# EAGLE design v1_1 (EAGLE 9.6.1)
CNAME: GSM Controll; CREVISION: 1.1; DESIGNER: Miroslav Pivovarsky
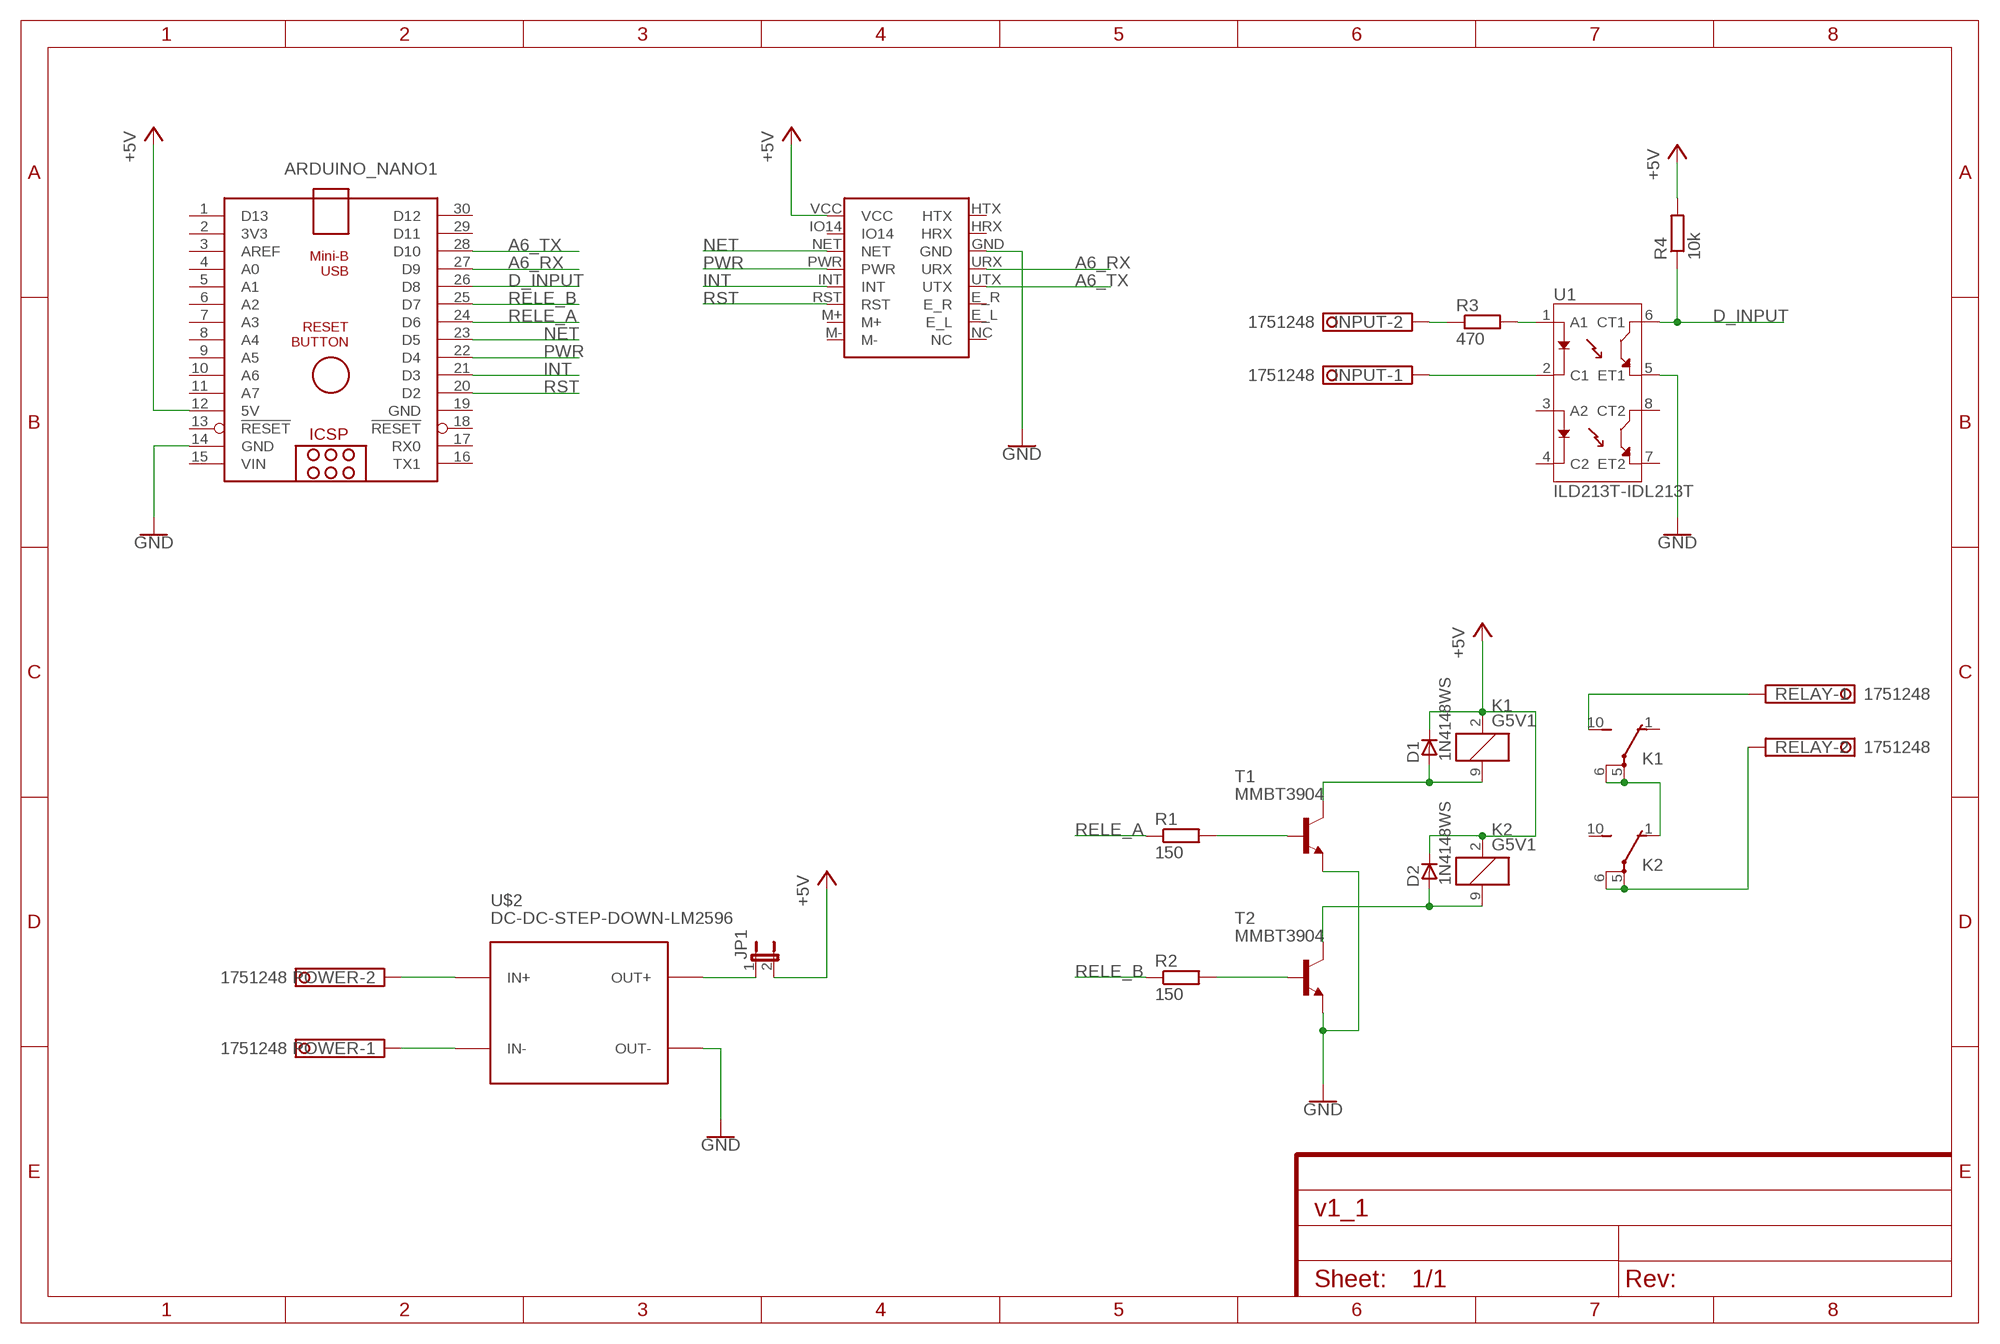
[diagram p0: schematic, sheet 1]

## Parts
ARDUINO_NANO1  ARDUINO_NANO  [ARDUINO_NANO]
D1  1N4148WS  [SOD323F]
D2  1N4148WS  [SOD323F]
INPUT  1751248  [1751248]
JP1  JP1E  [JP1]
K1  G5V1  [G5V1]
K2  G5V1  [G5V1]
POWER  1751248  [1751248]
R1  150  R-EU_R0805  [R0805]
R2  150  R-EU_R0805  [R0805]
R3  470  R-EU_R0805  [R0805]
R4  10k  R-EU_R0805  [R0805]
RELAY  1751248  [1751248]
T1  MMBT3904  MMBT3904LT1-NPN-SOT23-BEC  [SOT23-BEC]
T2  MMBT3904  MMBT3904LT1-NPN-SOT23-BEC  [SOT23-BEC]
U1  ILD213T-IDL213T  [SO08]
U$1  GPRS_A6_MINI  [A6_MINI]
U$2  DC-DC-STEP-DOWN-LM2596  [DC-DC-STEP-DOWN-LM2596]

## Nets
+5V: ARDUINO_NANO1.12(5V) D1.C D2.C JP1.2 K1.2 K2.2 R4.2 U$1.VCC
A6_RX: ARDUINO_NANO1.27(D9) U$1.URX
A6_TX: ARDUINO_NANO1.28(D10) U$1.UTX
D_INPUT: ARDUINO_NANO1.26(D8) R4.1 U1.6(CT1)
GND: ARDUINO_NANO1.14(GND) T1.E T2.E U1.5(ET1) U$1.GND U$2.OUT-
INT: ARDUINO_NANO1.21(D3) U$1.INT
N$1: POWER.2 U$2.IN+
N$2: POWER.1 U$2.IN-
N$3: K1.5(2:P) K1.6(2:P) K2.1(2:O)
N$4: JP1.1 U$2.OUT+
N$5: K2.5(2:P) K2.6(2:P) RELAY.2
N$6: K1.10(2:S) RELAY.1
N$7: INPUT.2 R3.1
N$8: D1.A K1.9 T1.C
N$9: INPUT.1 U1.2(C1)
N$10: D2.A K2.9 T2.C
N$11: R1.2 T1.B
N$12: R2.2 T2.B
N$13: R3.2 U1.1(A1)
NET: ARDUINO_NANO1.23(D5) U$1.NET
PWR: ARDUINO_NANO1.22(D4) U$1.PWR
RELE_A: ARDUINO_NANO1.24(D6) R1.1
RELE_B: ARDUINO_NANO1.25(D7) R2.1
RST: ARDUINO_NANO1.20(D2) U$1.RST
Unconnected: ARDUINO_NANO1.1(D13) ARDUINO_NANO1.2(3V3) ARDUINO_NANO1.3(AREF) ARDUINO_NANO1.4(A0) ARDUINO_NANO1.5(A1) ARDUINO_NANO1.6(A2) ARDUINO_NANO1.7(A3) ARDUINO_NANO1.8(A4) ARDUINO_NANO1.9(A5) ARDUINO_NANO1.10(A6) ARDUINO_NANO1.11(A7) ARDUINO_NANO1.13(!RESET) ARDUINO_NANO1.16(TX1) ARDUINO_NANO1.17(RX0) ARDUINO_NANO1.18(!RESET) ARDUINO_NANO1.29(D11) ARDUINO_NANO1.30(D12) K1.1(2:O) K2.10(2:S) U1.3(A2) U1.4(C2) U1.7(ET2) U1.8(CT2) U$1.E_L U$1.E_R U$1.HRX U$1.HTX U$1.IO14 U$1.M+ U$1.M- U$1.NC

## Power pins joined to a net without a drawn wire
GND: ARDUINO_NANO1.19(GND)
VIN: ARDUINO_NANO1.15(VIN)

## Library data of the parts
ARDUINO_NANO1 = ArduinoNanoV30:ARDUINO_NANO: Arduino Nano V3.0 Overview: The Arduino Nano is a small, complete, and breadboard-friendly board based on the ATmega328 (Arduino Nano 3.x) or ATmega168 (Arduino Nano 2.x). It has more or less the same functionality of the Arduino Duemilanove, but in a different package. It lacks only a DC power jack, and works with a Mini-B USB cable instead of a standard one. The Nano was designed and is being produced by Gravitech. Specifications: Microcontroller Atmel ATmega168 or ATmega328 Operating Voltage (logic level) 5 V Input Voltage (recommended) 7-12 V Input Voltage (limits) 6-20 V Digital I/O Pins 14 (of which 6 provide PWM output) Analog Input Pins 8 DC Current per I/O Pin 40 mA Flash Memory 16 KB (ATmega168) or 32 KB (ATmega328) of which 2 KB used by bootloader SRAM 1 KB (ATmega168) or 2 KB (ATmega328) EEPROM 512 bytes (ATmega168) or 1 KB (ATmega328) Clock Speed 16 MHz Dimensions 0.73" x 1.70" Length 45 mm Width 18 mm Weigth 5 g Power: The Arduino Nano can be powered via the Mini-B USB connection, 6-20V unregulated external power supply (pin 30), or 5V regulated external power supply (pin 27). The power source is automatically selected to the highest voltage source. Memory: The ATmega168 has 16 KB of flash memory for storing code (of which 2 KB is used for the bootloader); the ATmega328 has 32 KB, (also with 2 KB used for the bootloader). The ATmega168 has 1 KB of SRAM and 512 bytes of EEPROM (which can be read and written with the EEPROM library); the ATmega328 has 2 KB of SRAM and 1 KB of EEPROM. Input and Output: Each of the 14 digital pins on the Nano can be used as an input or output, using pinMode(), digitalWrite(), and digitalRead() functions. They operate at 5 volts. Each pin can provide or receive a maximum of 40 mA and has an internal pull-up resistor (disconnected by default) of 20-50 kOhms. In addition, some pins have specialized functions. Visit Arduino - ArduinoBoardNano <https://www.arduino.cc/en/Main/ArduinoBoardNano>
D1 D2 = _hhn_diodes_smd:1N4148WS: 1N4148 General Purpose Rectifie SMD-Version of 1N4148 Case: SOD 323 F Author: Dipl.-Ing. FH Rainer Bayer HHN Hochschule Heilbronn, rainer.bayer@hs-heilbronn.de Ingenieurbüro ing-rb, mail@ing-rb.de
INPUT POWER RELAY = con-phoenix-350:1751248: MKDS 1/ 2-3,5 Printklemme Nennstrom: 10 A Bemessungsspannung: 160 V Raster: 3,5 mm Polzahl: 2 Montageart: Löten Anschlussart: Schraubanschluss Anschlussrichtung vom Leiter zur Platine: 0° Source: http://eshop.phoenixcontact.com .. 1751248.pdf; OC_FARNELL: unknown; OC_NEWARK: unknown
JP1 = jumper:JP1E: JUMPER
K1 K2 = relay:G5V1: RELAY 1 x switch, 0.5 A/125 V AC, 1 A/24 V DC , Omron; MPN: G5V-1-DC24; OC_FARNELL: 9949593; OC_NEWARK: 36M6377
R1-R4 = rcl:R-EU_: RESISTOR, European symbol; SPICEPREFIX: R
T1 T2 = transistor:*-NPN-: NPN Transistror BF959 corrected 2008.03.06
U1 = SparkFun-DiscreteSemi:ILD213T: Dual Channel Phototransistor Optocoupler Dual Channel 70 V 4000 Vrms Phototransistor Optocoupler in a standard SOIC-8 package. Used to couple signals between electrically isolated circuits. Datasheet <https://www.sparkfun.com/datasheets/Components/SMD/ild205t.pdf> SparkFun Products: SparkFun Opto-Isolator Breakout <https://www.sparkfun.com/products/9118>; PROD_ID: IC-09076
U$1 = GPRS A6 mini:GPRS_A6_MINI
U$2 = acs712:DC-DC-STEP-DOWN-LM2596: DC/DC Step-Down Regulator based on LM2596-ADJ chip LM2596 datasheet available here: http://www.ti.com/lit/ds/symlink/lm2596.pdf Click here to find device on ebay.com <http://www.ebay.com/sch/lm2596+power+regulator>

## Board
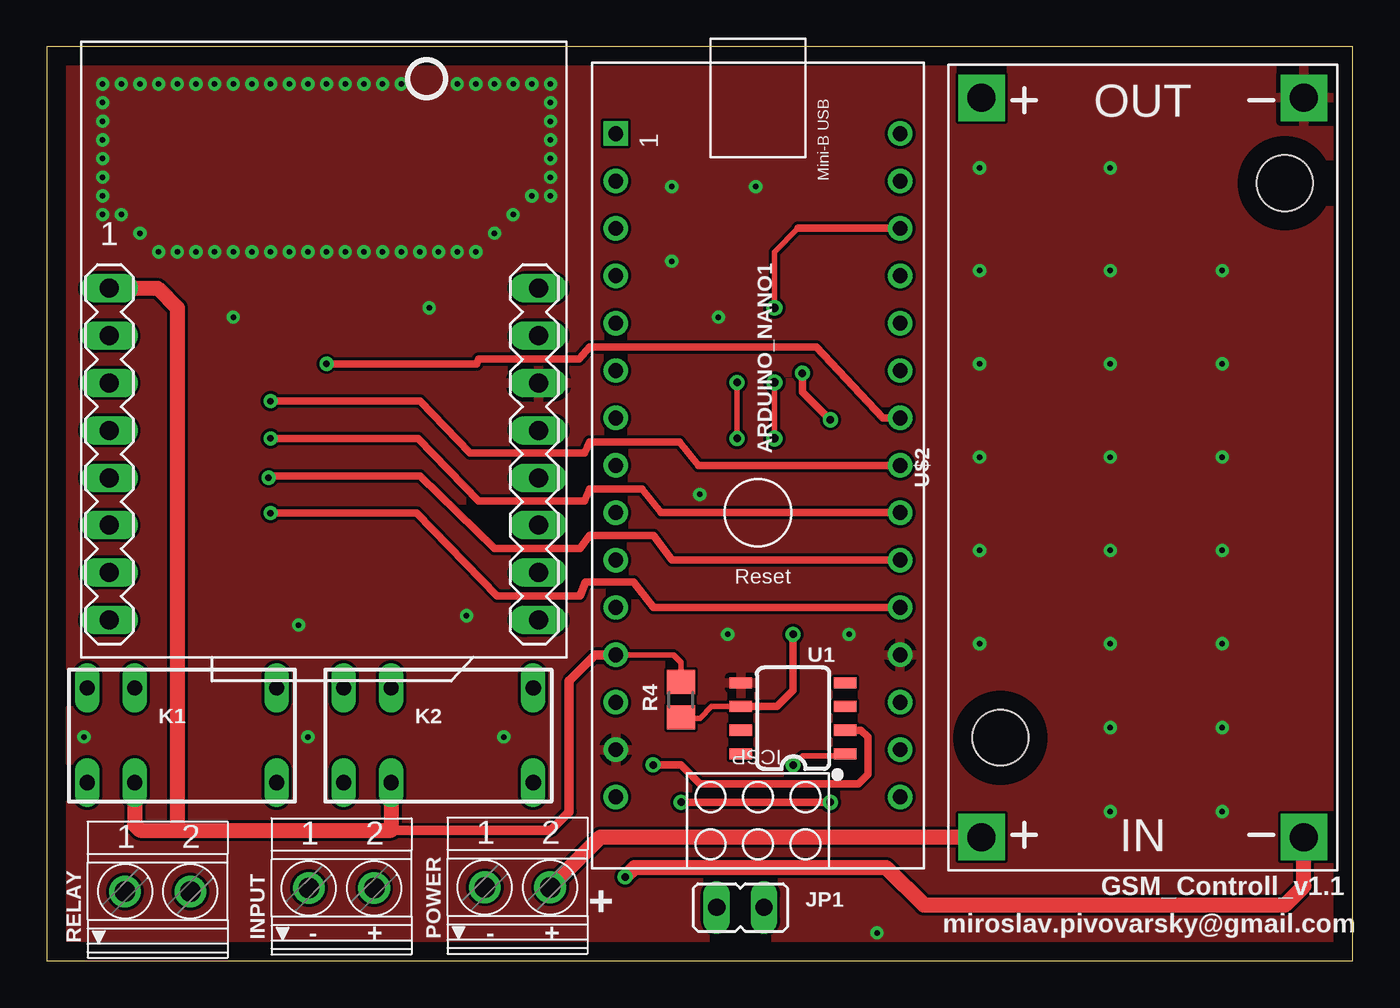
[diagram p1: board, top side]
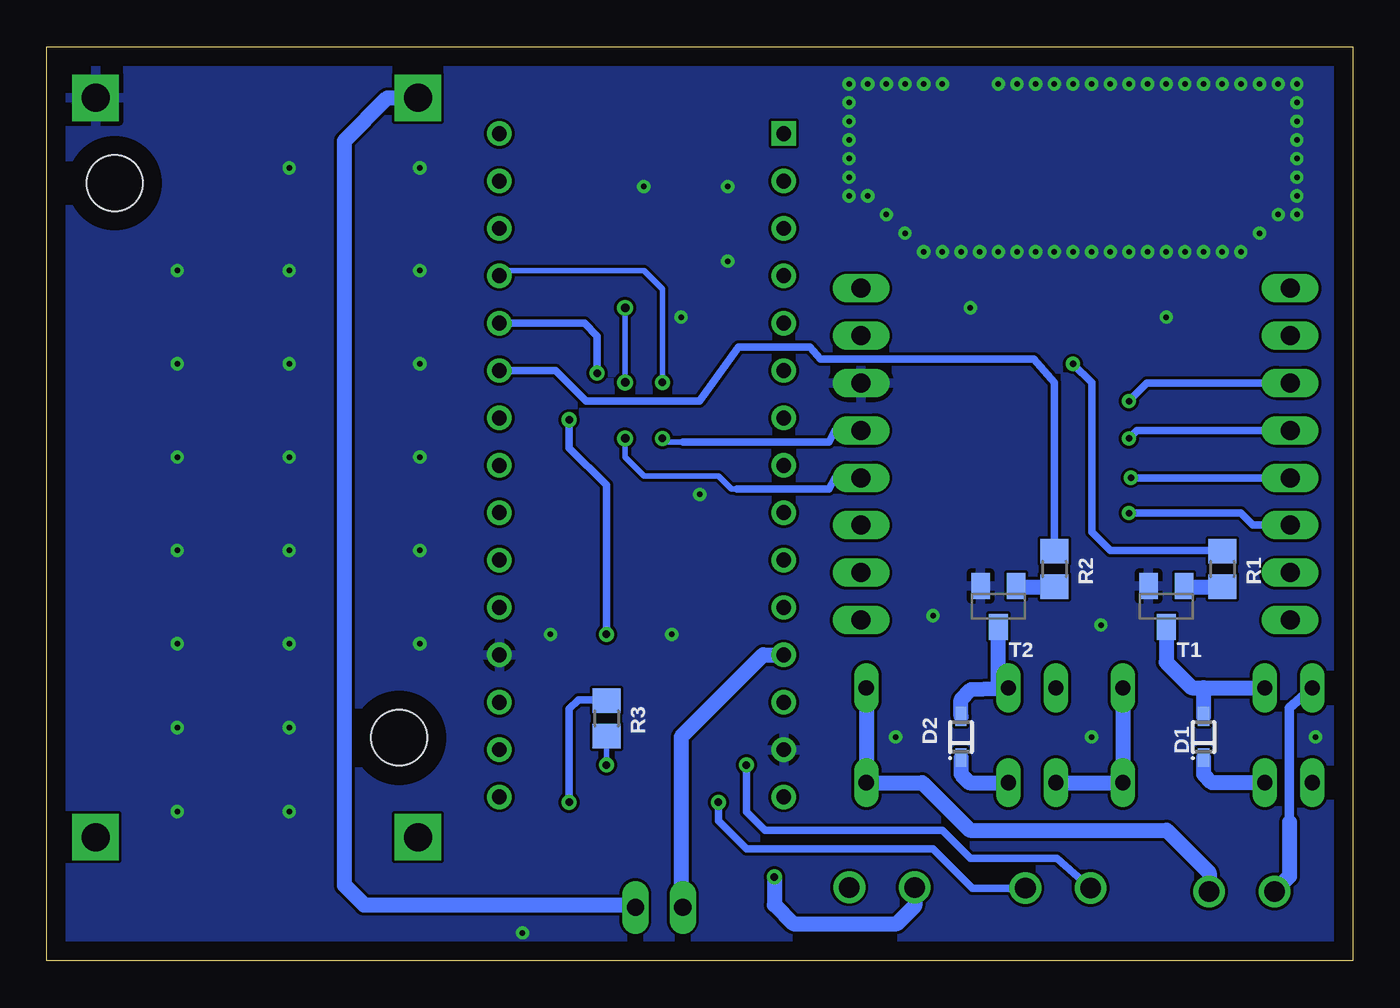
[diagram p2: board, bottom side, seen from below]

Size 70 x 49 mm. Coordinates in mm from the lower left corner, seen from the top.
Outline: 0,0 70,0 70,49 0,49 0,0
Copper layers (1*16): Top 0.035mm / dielectric 1.5mm / Bottom 0.035mm
Design rules "default *": minimum track width 6mil, minimum drill 0.35mm, track to track 6mil, track to pad 6mil, pad to pad 6mil, via to via 6mil, smd to smd 6mil, copper to edge 40mil, drill to drill 6mil, minimum pad ring 10mil, minimum via ring 8mil, stop-mask expansion 4mil, vias tented up to drill 55mil, thermal gap 10mil

### Footprints (pad centres in the part's own frame; a part is rotated, then mirrored left to right if it is on the bottom)
ARDUINO_NANO = drill 0.8 square: 1 -20.32,-7.62 | drill 0.8: 2 -17.78,-7.62; 3 -15.24,-7.62; 4 -12.7,-7.62; 5 -10.16,-7.62; 6 -7.62,-7.62; 7 -5.08,-7.62; 8 -2.54,-7.62; 9 0,-7.62; 10 2.54,-7.62; 11 5.08,-7.62; 12 7.62,-7.62; 13 10.16,-7.62; 14 12.7,-7.62; 15 15.24,-7.62; 16 15.24,7.62; 17 12.7,7.62; 18 10.16,7.62; 19 7.62,7.62; 20 5.08,7.62; 21 2.54,7.62; 22 0,7.62; 23 -2.54,7.62; 24 -5.08,7.62; 25 -7.62,7.62; 26 -10.16,7.62; 27 -12.7,7.62; 28 -15.24,7.62; 29 -17.78,7.62; 30 -20.32,7.62
SOD323F = smd 1 x 0.6: A 1.1,0; C -1.1,0
1751248 = drill 1.1 pad 1.7: 1 -1.75,-0.1; 2 1.75,-0.1
JP1 = drill 0.914 long: 1 0,-1.27; 2 0,1.27
G5V1 = drill 0.813 long: 1 -5.08,-2.54; 2 -2.54,-2.54; 5 5.08,-2.54; 6 5.08,2.54; 9 -2.54,2.54; 10 -5.08,2.54
R0805 = smd 1.3 x 1.5: 1 -0.95,0; 2 0.95,0
SOT23-BEC = smd 1 x 1.4: B -0.95,-1.1; C 0,1.1; E 0.95,-1.1
SO08 = smd 0.6 x 1.2: 1 -1.905,-2.8; 2 -0.635,-2.8; 3 0.635,-2.8; 4 1.905,-2.8; 5 1.905,2.8; 6 0.635,2.8; 7 -0.635,2.8; 8 -1.905,2.8
A6_MINI = drill 1.016 long: E_L 25,4.54; E_R 25,7.08; GND 25,14.7; HRX 25,17.24; HTX 25,19.78; INT 2,9.62; IO14 2,17.24; M+ 2,4.54; M- 2,2; NC 25,2; NET 2,14.7; PWR 2,12.16; RST 2,7.08; URX 25,12.16; UTX 25,9.62; VCC 2,19.78
DC-DC-STEP-DOWN-LM2596 = drill 1.5 pad 2.5 square: IN+ -19.812,8.636; IN- -19.812,-8.636; OUT+ 19.812,8.636; OUT- 19.812,-8.636 | hole 3: -14.478,7.62; 15.24,-7.62

### Placement (x,y rotation side)
ARDUINO_NANO1  38.12,24.02 270 top
D1  8,12 90 bottom
D2  21,12 90 bottom
INPUT  15.8,4 0 top
JP1  37.18,2.86 90 top
K1  7.25,12.09 0 top
K2  21,12.09 0 top
POWER  25.23,4.04 0 top
R1  7,21 270 bottom
R2  16,21 270 bottom
R3  40,13 270 bottom
R4  34,14 90 top
RELAY  5.95,3.82 0 top
T1  10,19 180 bottom
T2  19,19 180 bottom
U1  40,13 90 top
U$1  1.36,16.27 0 top
U$2  58.74,26.44 90 top

### Tracks (layer width: path | path; a pad name or v marks a point on that pad's centre or on a via)
+5V
  Top 0.305: R4.2 34,16 33.6,16.4 ARDUINO_NANO1.12
  Top 0.508: 18.46,7 27,7 28,8 28,15 29.4,16.4 ARDUINO_NANO1.12
  Top 0.813: K1.2 4.71,7.29 5,7 7,7 | 7,7 18.46,7 K2.2 | U$1.VCC 5.95,36.05 7,35 7,7
  Bottom 0.813: K1.2 7.55,9.55 8,10 D1.C | D2.C 21,10 20.55,9.55 K2.2 | JP1.2 36,2.95 36,12 31.6,16.4 ARDUINO_NANO1.12
A6_RX  (via drill 0.4)
  Top 0.305: v37,28 v37,31
  Bottom 0.305: 35.91,27.8 36.8,27.8 v37,28 | v37,31 37,36 38,37 45.46,37 ARDUINO_NANO1.27
  Bottom 0.406: 35.91,27.8 28.08,27.8 27.74,28.43 U$1.URX
A6_TX  (via drill 0.45)
  Top 0.305: v39,28 v39,31 | v39,35 39,38 40.26,39.26
  Top 0.406: 40.26,39.26 ARDUINO_NANO1.28
  Bottom 0.305: 33,25.3 33.3,25.3 34,26 38,26 39,27 v39,28 | v39,31 v39,35
  Bottom 0.406: U$1.UTX 27.74,25.89 28.08,25.3 33,25.3
D_INPUT  (via drill 0.4)
  Top 0.305: U1.6 35.63,13.63 35,13 34.05,13 R4.1
  Top 0.406: U1.6 39.13,13.63 40,14.5 v40,17.5 | v42,29 40.5,30.5 v40.5,31.5
  Bottom 0.406: v40,17.5 40,25.5 42,27.5 v42,29 | v40.5,31.5 40.5,33.5 41.18,34.18 ARDUINO_NANO1.26
GND  (via drill 0.3)
  other vias: 3,47 3,46 3,45 3,44 3,43 3,42 3,41 3,40 4,40 5,39 6,38 7,38 8,38 9,38 10,38 11,38 12,38 13,38 14,38 15,38 16,38 17,38 18,38 19,38 20,38 21,38 22,38 23,38 24,39 25,40 26,41 27,41 27,42 27,43 27,44 27,45 27,46 27,47 26,47 25,47 24,47 23,47 22,47 18,47 17,47 19,47 16,47 15,47 14,47 13,47 12,47 11,47 10,47 9,47 8,47 7,47 6,47 5,47 4,47 35,25 44.5,1.5 10,34.5 20.5,35 22.5,18.5 13.5,18 24.5,12 14,12 57,42.5 57,37 57,32 57,27 57,22 57,17 57,12.5 57,8 63,8 63,12.5 63,17 63,22 63,27 63,32 63,37 50,37 50,32 50,27 50,22 50,17 50,42.5 33.5,41.5 38,41.5 33.5,37.5 36,34.5 36.5,17.5 43,17.5 2,12
  pour Top: 0,49 70,49 70,0 0,0
  pour Bottom: 0,49 70,49 70,0 0,0
INT  (via drill 0.35)
  Top 0.406: ARDUINO_NANO1.21 33.52,21.48 32.51,22.8 29.08,22.8 28.59,22.1 24,22.1 20,26 12,26 v11.89,25.89
  Bottom 0.406: U$1.INT v11.89,25.89
N$1
  Top 0.813: U$2.IN+ 34.5,6.63 29.67,6.63 POWER.2
N$2  (via drill 0.4)
  Top 0.813: U$2.IN- 67.38,4 66.38,3 47,3 45,5 31.5,5 v31,4.5
  Bottom 0.813: v31,4.5 31,3 30,2 24.42,2 23.48,2.94 POWER.1
N$3
  Bottom 0.813: K1.6 K1.5 K2.1
N$4
  Bottom 0.813: U$2.OUT+ 51.75,46.25 54.04,43.96 54.04,4.04 53,3 38.59,3 JP1.1
N$5
  Bottom 0.813: K2.6 K2.5 23.08,9.55 20.53,7 9.98,7 7.7,4.72 RELAY.2
N$6
  Bottom 0.508: K1.10 3.4,13.56 3.4,7.45
  Bottom 0.813: 3.4,7.45 3.4,4.52 RELAY.1
N$7  (via drill 0.4)
  Top 0.406: v34,8.5 v42,8.5
  Bottom 0.406: INPUT.2 20.4,3.9 22.5,6 32.5,6 34,7.5 v34,8.5 | v42,8.5 42,13.5 41.5,14 40.05,14 R3.1
N$8
  Bottom 0.813: T1.C 10,16 8.63,14.63 8,14.63 | 8,14.63 K1.9 | D1.A 8,14.63
N$9  (via drill 0.4)
  Top 0.406: v32.5,10.5 34,10.5 35,9.5 43.5,9.5 44,10 44,12 43.63,12.37 U1.2
  Bottom 0.406: INPUT.1 15.85,5.5 20.5,5.5 22,7 31.5,7 32.5,8 v32.5,10.5
N$10
  Bottom 0.813: T2.C 19,15.08 K2.9 20.46,14.54 21,14 D2.A
N$11
  Bottom 0.813: T1.B 9,20.05 R1.2
N$12
  Bottom 0.813: T2.B 18,20.05 R2.2
N$13  (via drill 0.4)
  Top 0.305: U1.1 42.7,11 40.5,11 v40,10.5
  Bottom 0.305: v40,10.5 R3.2
NET  (via drill 0.35)
  Top 0.406: ARDUINO_NANO1.23 34.93,26.56 33.92,27.8 29.08,27.8 28.82,27.21 22.69,27.21 20,30 v12,30
  Bottom 0.406: U$1.NET 11.03,30.97 v12,30
PWR  (via drill 0.35)
  Top 0.406: v12,28 19.91,28 23.14,24.66 28.82,24.66 29.08,25.3 31.92,25.3 32.93,24.02 ARDUINO_NANO1.22
  Bottom 0.406: U$1.PWR 11.57,28.43 v12,28
RELE_A  (via drill 0.35)
  Top 0.406: v15,32 23.05,32 23.14,32.25 28.52,32.25 29.08,32.9 41.26,32.9 44.81,29.1 ARDUINO_NANO1.24
  Bottom 0.406: R1.1 7.05,22 13,22 14,23 14,31 v15,32
RELE_B
  Bottom 0.406: R2.1 16,31 17.09,32.25 28.52,32.25 29.08,32.9 32.92,32.9 35.01,30 41.1,30 42.74,31.64 ARDUINO_NANO1.25
RST  (via drill 0.35)
  Top 0.406: v12,24 19.83,24 24.14,19.57 28.59,19.57 28.89,20.3 31.46,20.3 32.52,18.94 ARDUINO_NANO1.20
  Bottom 0.406: U$1.RST 5.35,23.35 6,24 v12,24

### Text on the board
tNames: GSM_Controll_v1.1 | - | + | - | + | + | miroslav.pivovarsky@gmail.com